# Altium schematic sheet Sheet1.SchDoc
size D
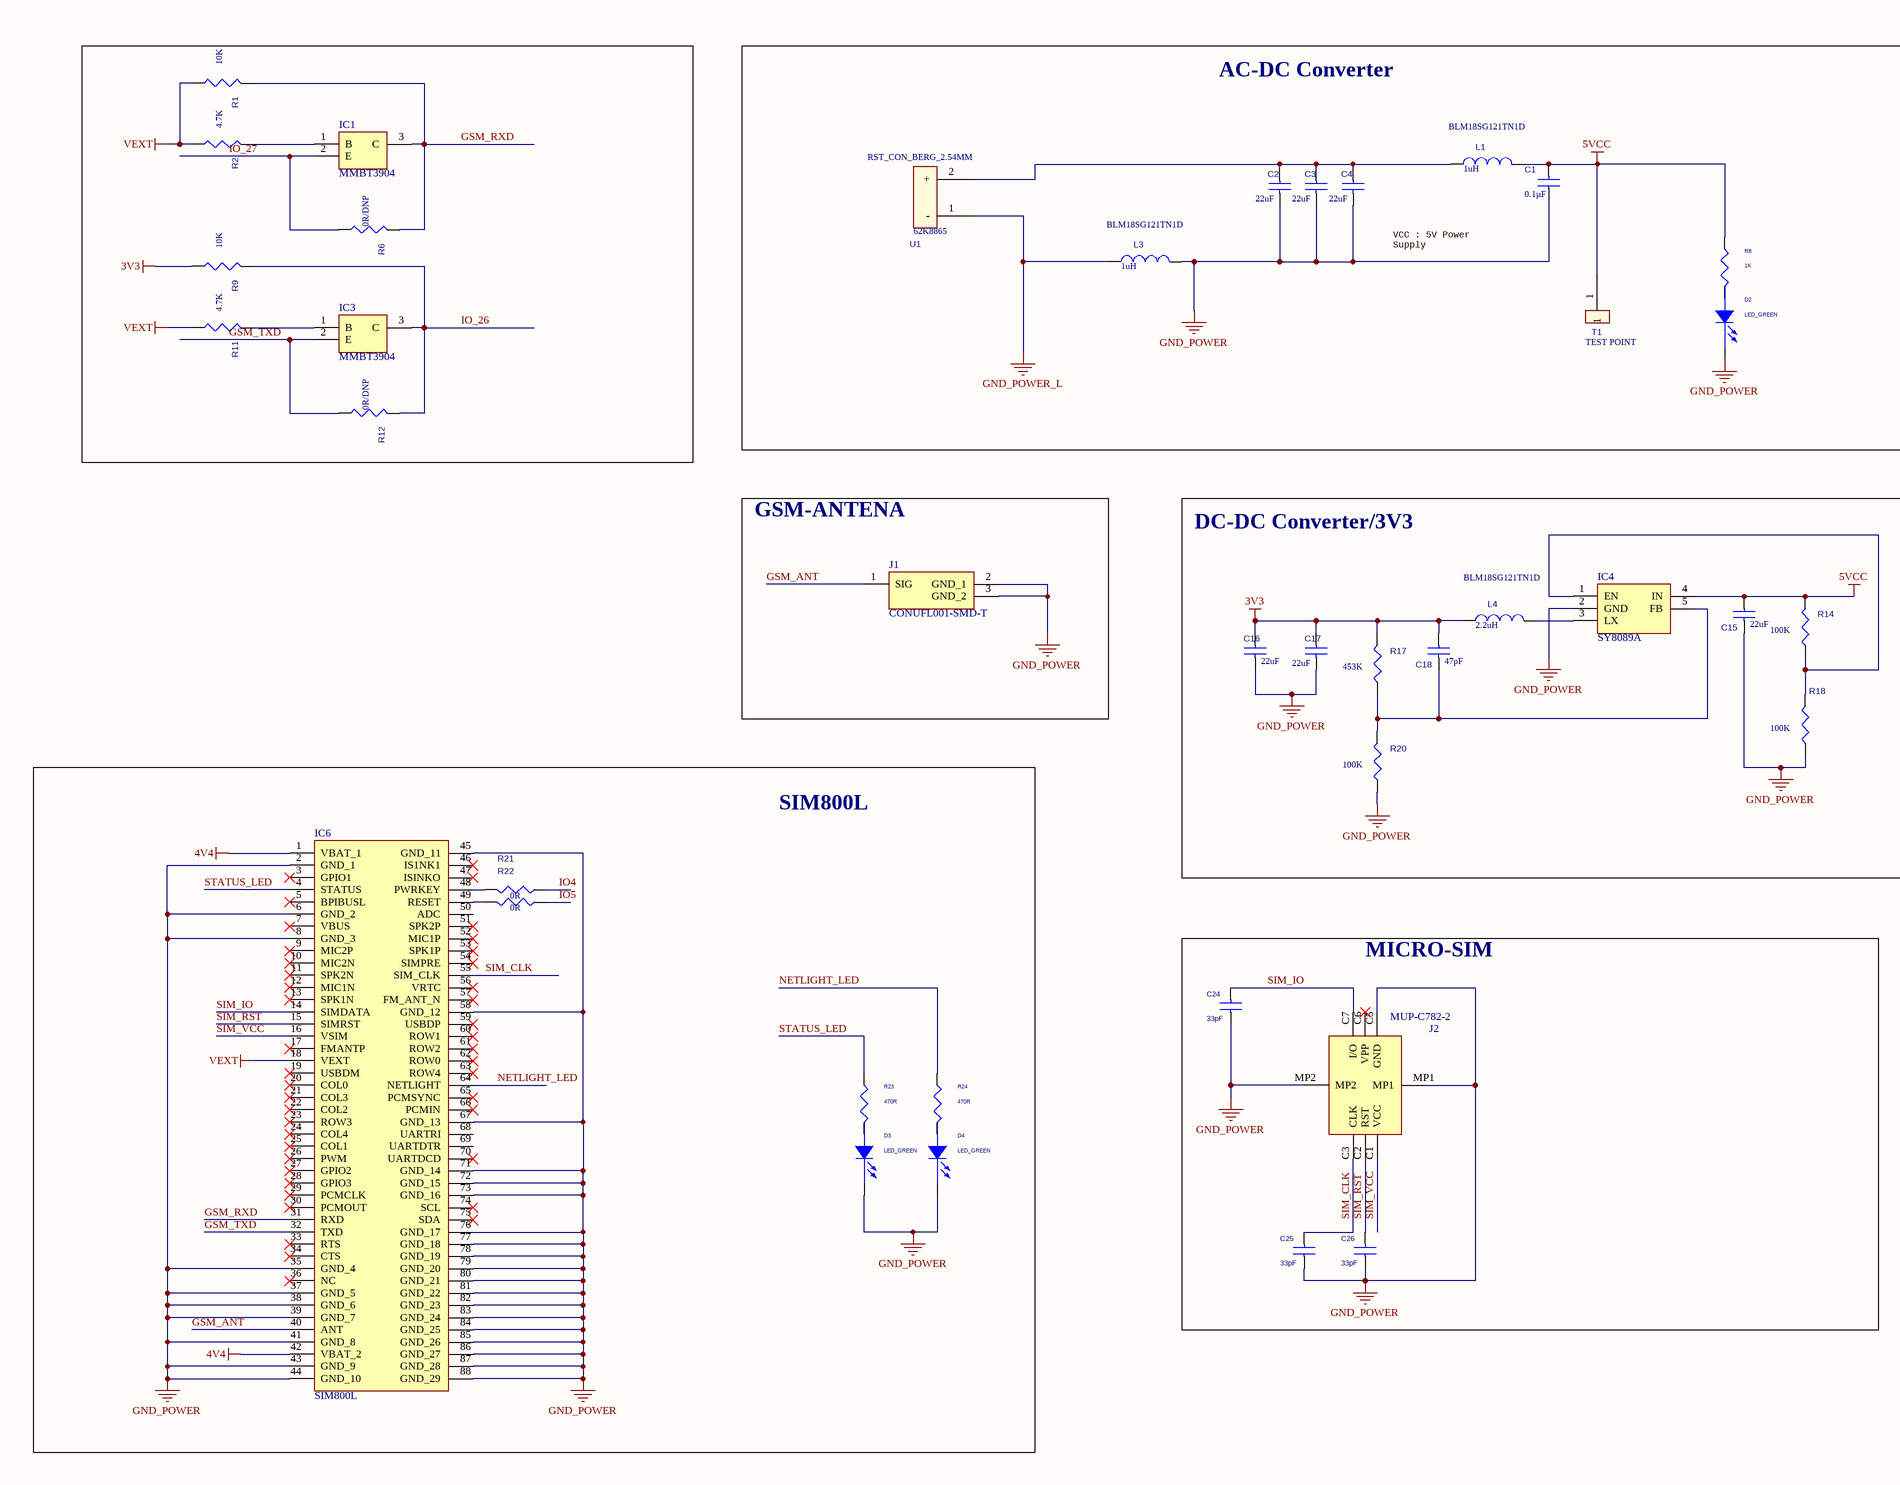
[diagram p0: Sheet1.SchDoc, left]
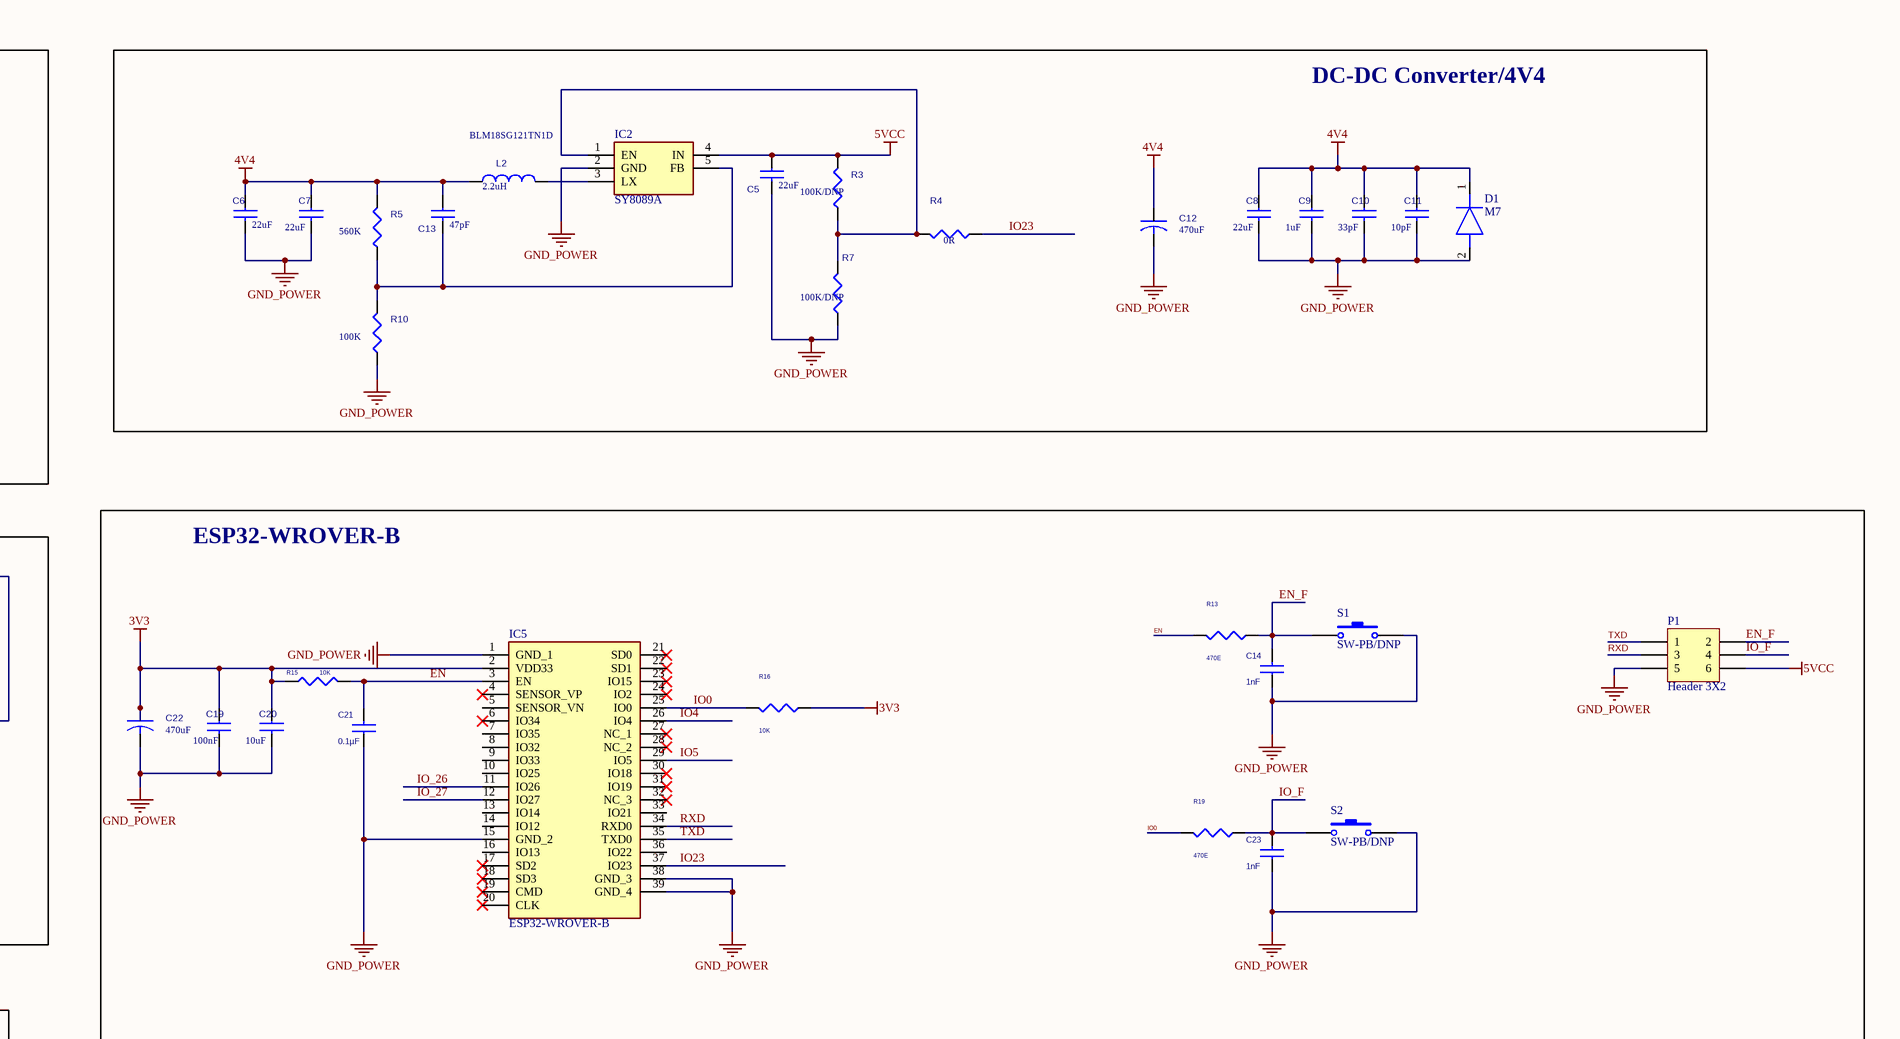
[diagram p1: Sheet1.SchDoc, right]

## Parts
C1  0.1µF  [C0603]
C2  22uF  [C0603]
C3  22uF  [C0603]
C4  22uF  [C0603]
C5  22uF  [C0603]
C6  22uF  [C0603]
C7  22uF  [C0603]
C8  22uF  [C0603]
C9  1uF  [C0603]
C10  33pF  [C0603]
C11  10pF  [C0603]
C12  470uF  [C16, C49, C58]
C13  47pF  [C0603]
C14  1nF  [0603 Capacitor]
C15  22uF  [C0603]
C16  22uF  [C0603]
C17  22uF  [C0603]
C18  47pF  [C0603]
C19  100nF  [C0603]
C20  10uF  [C0603]
C21  0.1µF  [0603 Capacitor]
C22  470uF  [25ZLH470MEFC10X12.5]
C23  1nF  [0603 Capacitor]
C24  33pF  [C0603]
C25  33pF  [C0603]
C26  33pF  [C0603]
D1  M7  [D1]
D2  LED_GREEN  [D2              L0603]
D3  LED_GREEN  [D2              L0603]
D4  LED_GREEN  [D2              L0603]
IC1  MMBT3904  [SOT95P240X120-3N]
IC2  SY8089A  [SOT95P285X140-5N]
IC3  MMBT3904  [SOT95P240X120-3N]
IC4  SY8089A  [SOT95P285X140-5N]
IC5  ESP32-WROVER-B  [MODULE_ESP32-WROVER-B]
IC6  SIM800L  [SIM800L]
J1  CONUFL001-SMD-T  [CONUFL001-SMD]
J2  MUP-C782-2  [MUPC7822]
L1  1uH  Supplier Part Number 1: BLM18SG121TN1D  [L3, L4, L5, L6, L7]
L2  2.2uH  Supplier Part Number 1: BLM18SG121TN1D  [L3, L4, L5, L6, L7]
L3  1uH  Supplier Part Number 1: BLM18SG121TN1D  [L3, L4, L5, L6, L7]
L4  2.2uH  Supplier Part Number 1: BLM18SG121TN1D  [L3, L4, L5, L6, L7]
P1  Header 3X2  [HDR2X3]
R1  10K  [R0603]
R2  4.7K  [R0603]
R3  100K/DNP  [R0603]
R4  0R  [R0603]
R5  560K  [R0603]
R6  0R/DNP  [R0603]
R7  100K/DNP  [R0603]
R8  1K  [R0603]
R9  10K  [R0603]
R10  100K  [R0603]
R11  4.7K  [R0603]
R12  0R/DNP  [R0603]
R13  470E  [R_0603_W]
R14  100K  [R0603]
R15  10K  [R_0603_W]
R16  10K  [R_0603_W]
R17  453K  [R0603]
R18  100K  [R0603]
R19  470E  [R_0603_W]
R20  100K  [R0603]
R21  0R  [R0603]
R22  0R  [R0603]
R23  470R  [R0603]
R24  470R  [R0603]
S1  SW-PB/DNP  [*TE_FSMSM]
S2  SW-PB/DNP  [*TE_FSMSM]
T1  TEST POINT  [TP]
U1  RST_CON_BERG_2.54MM  Supplier Part Number 1: 62K8865  [U23]

## Blocks framed on the sheet
AC-DC Converter: C1-C4 D2 L1 L3 R8 T1 U1
DC-DC Converter/4V4: C5-C13 D1 IC2 L2 R3-R5 R7 R10
GSM-ANTENA: J1
DC-DC Converter/3V3: C15-C18 IC4 L4 R14 R17 R18 R20
ESP32-WROVER-B: C14 C19-C23 IC5 P1 R13 R15 R16 R19 S1 S2
SIM800L: D3 D4 IC6 R21-R24
MICRO-SIM: C24-C26 J2

## Nets
3V3: C16.1 C17.1 C18.1 C19.1 C20.1 C22.1 IC5.2(VDD33) L4.1 R9.2 R15.1 R16.1 R17.1
4V4: C6.1 C7.1 C8.1 C9.1 C10.1 C11.1 C12.1 C13.1 D1.1(K) IC6.1(VBAT_1) IC6.42(VBAT_2) L2.1 R5.1
5VCC: C1.2 C5.1 C15.1 IC2.4(IN) IC4.4(IN) L1.2 P1.6 R3.1 R8.1 R14.1 T1.1
GND_POWER: C1.1 C2.2 C3.2 C4.2 C5.2 C6.2 C7.2 C8.2 C9.2 C10.2 C11.2 C12.2 C14.1 C15.2 C16.2 C17.2 C19.2 C20.2 C21.1 C22.2 C23.1 C24.1 C25.1 C26.1 D1.2(A) D2.2(CATHODE) D3.2(CATHODE) D4.2(CATHODE) IC2.2(GND) IC4.2(GND) IC5.1(GND_1) IC5.15(GND_2) IC5.38(GND_3) IC5.39(GND_4) IC6.2(GND_1) IC6.6(GND_2) IC6.8(GND_3) IC6.35(GND_4) IC6.37(GND_5) IC6.38(GND_6) IC6.39(GND_7) IC6.41(GND_8) IC6.43(GND_9) IC6.44(GND_10) IC6.45(GND_11) IC6.58(GND_12) IC6.67(GND_13) IC6.71(GND_14) IC6.72(GND_15) IC6.73(GND_16) IC6.76(GND_17) IC6.77(GND_18) IC6.78(GND_19) IC6.79(GND_20) IC6.80(GND_21) IC6.81(GND_22) IC6.82(GND_23) IC6.83(GND_24) IC6.84(GND_25) IC6.85(GND_26) IC6.86(GND_27) IC6.87(GND_28) IC6.88(GND_29) J1.2(GND_1) J1.3(GND_2) J2.C5(GND) J2.MP1 J2.MP2 L3.2 P1.5 R7.2 R10.2 R18.2 R20.2 S1.2 S2.2
GND_POWER_L: L3.1 U1.1(-)
VEXT: IC6.18(VEXT) R1.2 R2.2 R11.2
EN: C21.2 IC5.3(EN) R13.2 R15.2
EN_F: C14.2 P1.2 R13.1 S1.1
GSM_ANT: IC6.40(ANT) J1.1(SIG)
GSM_RXD: IC1.3(C) IC6.31(RXD) R1.1 R6.1
GSM_TXD: IC3.2(E) IC6.32(TXD) R12.2
IO0: IC5.25(IO0) R16.2 R19.2
IO4: IC5.26(IO4) R21.1
IO5: IC5.29(IO5) R22.1
IO23: IC5.37(IO23) R4.1
IO_26: IC3.3(C) IC5.11(IO26) R9.1 R12.1
IO_27: IC1.2(E) IC5.12(IO27) R6.2
IO_F: C23.2 P1.4 R19.1 S2.1
NETLIGHT_LED: IC6.64(NETLIGHT) R24.1
RXD: IC5.34(RXD0) P1.3
SIM_CLK: C25.2 IC6.55(SIM_CLK) J2.C3(CLK)
SIM_IO: C24.2 IC6.14(SIMDATA) J2.C7(I/O)
SIM_RST: C26.2 IC6.15(SIMRST) J2.C2(RST)
SIM_VCC: IC6.16(VSIM) J2.C1(VCC)
STATUS_LED: IC6.4(STATUS) R23.1
TXD: IC5.35(TXD0) P1.1
NetC2_1: C2.1 C3.1 C4.1 L1.1 U1.2(+)
NetC13_2: C13.2 IC2.5(FB) R5.2 R10.1
NetC18_2: C18.2 IC4.5(FB) R17.2 R20.1
NetD2_1: D2.1(ANODE) R8.2
NetD3_1: D3.1(ANODE) R23.2
NetD4_1: D4.1(ANODE) R24.2
NetIC1_1: IC1.1(B) R2.1
NetIC2_1: IC2.1(EN) R3.2 R4.2 R7.1
NetIC2_3: IC2.3(LX) L2.2
NetIC3_1: IC3.1(B) R11.1
NetIC4_1: IC4.1(EN) R14.2 R18.1
NetIC4_3: IC4.3(LX) L4.2
NetIC6_48: IC6.48(PWRKEY) R21.2
NetIC6_49: IC6.49(RESET) R22.2

Not connected (* = marked no-connect by the designer): IC5 4(SENSOR_VP)* 5(SENSOR_VN) 6(IO34)* 7(IO35) 8(IO32) 9(IO33) 10(IO25) 13(IO14) 14(IO12) 16(IO13) 17(SD2)* 18(SD3)* 19(CMD)* 20(CLK)* 21(SD0)* 22(SD1)* 23(IO15)* 24(IO2)* 27(NC_1)* 28(NC_2)* 30(IO18)* 31(IO19)* 32(NC_3)* 33(IO21) 36(IO22); IC6 3(GPIO1)* 5(BPIBUSL)* 7(VBUS)* 9(MIC2P)* 10(MIC2N)* 11(SPK2N)* 12(MIC1N)* 13(SPK1N)* 17(FMANTP)* 19(USBDM)* 20(COL0)* 21(COL3)* 22(COL2)* 23(ROW3)* 24(COL4)* 25(COL1)* 26(PWM)* 27(GPIO2)* 28(GPIO3)* 29(PCMCLK)* 30(PCMOUT)* 33(RTS)* 34(CTS)* 36(NC)* 46(IS1NK1)* 47(ISINKO)* 50(ADC) 51(SPK2P)* 52(MIC1P)* 53(SPK1P)* 54(SIMPRE)* 56(VRTC)* 57(FM_ANT_N)* 59(USBDP)* 60(ROW1)* 61(ROW2)* 62(ROW0)* 63(ROW4)* 65(PCMSYNC)* 66(PCMIN)* 68(UARTRI) 69(UARTDTR) 70(UARTDCD)* 74(SCL)* 75(SDA)*; J2 C6(VPP)*

## Notes on the sheet
- VCC : 5V Power Supply
  D-  : USB D- Signal
  D+ : USB D+ Signal
  ID  : USB Identifier Signal for OTG Devices
  GND : Power Ground
- Title
- Size:
- Date:
- File:
- D
- Number:
- Time:
- Revision:
- Sheet
- of

## Library data of the parts
C1 C14 C21 C23 = CAP_C_0.1µF/16V: CAP CER SMD 0.1µF/16V; Manufacturer: Murata Electronics North America; Manufacturer Part Number: GRM155R61H104KE19D; Tolerance: ±10%; Voltage - Rated: 16V; Temperature Coefficient: X5R; Supplier 1: Digi-Key; Supplier Part Number 1: 490-11917-1-ND; RoHS: RoHS Compliant; Category: Capacitors; Stock 1: 958509; Pricing 1: 1=0.1, 10=0.062, 25=0.0456, 50=0.034, 100=0.0278, 250=0.02328, 500=0.01988, 1000=0.01562, 5000=0.01307 (USD); Packaging: Cut Tape (CT); Part Status: Active; Operating Temperature: -55°C ~ 85°C; Features: -; Ratings: -; Applications: General Purpose; Mounting Type: Surface Mount, MLCC; Package / Case: 0402 (1005 Metric); Size / Dimension: 0.039" L x 0.020" W (1.00mm x 0.50mm); Height - Seated (Max): -; Thickness (Max): 0.022" (0.55mm); Lead Spacing: -; Lead Style: -; ComponentLink1URL: http://www.murata.com/~/media/webrenewal/support/library/catalog/products/capacitor/mlcc/c02e.ashx; ComponentLink1Description: http://www.murata.com/~/media/webrenewal/support/library/catalog/products/capacitor/mlcc/c02e.ashx
  C1 C21: Capacitance: 0.1µF
  C14 C23: Capacitance: 1nF
C2-C11 C13 C15-C20 = CAP NP: CAP CER 22UF 10V X5R 0603; Part Number: GRM188R61A226ME15D
C12 C22 = CAP: CAP ALUM 470UF 20% 50V RADIAL; Part Number: 871-B41896E6477M000
C24-C26 = CAP_C_0.1µF/16V: CAP CER SMD 0.1µF/16V; Manufacturer: Murata Electronics North America; Manufacturer Part Number: GRM155R61H104KE19D; Capacitance: 0.1µF; Tolerance: ±10%; Voltage - Rated: 16V; Temperature Coefficient: X5R; Supplier 1: Digi-Key; Supplier Part Number 1: 490-11917-1-ND; RoHS: RoHS Compliant; Category: Capacitors; Stock 1: 958509; Pricing 1: 1=0.1, 10=0.062, 25=0.0456, 50=0.034, 100=0.0278, 250=0.02328, 500=0.01988, 1000=0.01562, 5000=0.01307 (USD); Packaging: Cut Tape (CT); Part Status: Active; Operating Temperature: -55°C ~ 85°C; Features: -; Ratings: -; Applications: General Purpose; Mounting Type: Surface Mount, MLCC; Package / Case: 0402 (1005 Metric); Size / Dimension: 0.039" L x 0.020" W (1.00mm x 0.50mm); Height - Seated (Max): -; Thickness (Max): 0.022" (0.55mm); Lead Spacing: -; Lead Style: -; ComponentLink1URL: http://www.murata.com/~/media/webrenewal/support/library/catalog/products/capacitor/mlcc/c02e.ashx; ComponentLink1Description: http://www.murata.com/~/media/webrenewal/support/library/catalog/products/capacitor/mlcc/c02e.ashx
D1 = M7: Diode; Manufacturer_Name: LGE; Datasheet Link: https://datasheet.lcsc.com/szlcsc/LGE-M7-SMAJ_C330214.pdf; Height: 2.45mm; Manufacturer_Part_Number: M7
D2-D4 = LED: LED GREEN CLEAR THIN 0603 SMD; Manufacturer Part Number: 160-1443-2-ND; Type: Diode; Distributor Part Number: 160-1443-1-ND; Package: 0603; Part Number: 160-1443-2-ND
IC1 IC3 = MMBT3904: Integrated Circuit; Manufacturer_Name: Diotec; Datasheet Link: https://media.digikey.com/pdf/Data%20Sheets/ON%20Semiconductor%20PDFs/2N3904,MMBT3904,PZT3904.pdf; Height: 1.2mm; Manufacturer_Part_Number: MMBT3904; Arrow Part Number: MMBT3904; Arrow Price/Stock: https://www.arrow.com/en/products/mmbt3904/diotec-semiconductor-ag?region=europe
IC2 IC4 = SY8089A: Integrated Circuit; Manufacturer_Name: Silergy; Datasheet Link: https://datasheet.lcsc.com/szlcsc/SY8089AAAC_C78988.pdf; Height: 1.4mm; Manufacturer_Part_Number: SY8089A
IC5 = ESP32-WROVER-B: Integrated Circuit; Manufacturer_Name: Espressif Systems; Datasheet Link: https://www.espressif.com/sites/default/files/documentation/esp32-wrover-b_datasheet_en.pdf; Manufacturer_Part_Number: ESP32-WROVER-B; Mouser Part Number: 356-ESP32-WROVER-B; Mouser Price/Stock: https://www.mouser.co.uk/ProductDetail/Espressif-Systems/ESP32-WROVER-B?qs=w%2Fv1CP2dgqr%2FL2PHL8uSAQ%3D%3D
IC6 = SIM800L: Integrated Circuit; Manufacturer_Name: SIMCOM; Datasheet Link: http://img.filipeflop.com/files/download/Datasheet_SIM800L.pdf; Height: 2.55mm; Manufacturer_Part_Number: SIM800L
J1 = CONUFL001-SMD-T: Connector; Manufacturer_Name: Linx Technologies; Datasheet Link: https://linxtechnologies.com/wp/product/mhf-rf-connectors/; Manufacturer_Part_Number: CONUFL001-SMD-T; Mouser Part Number: 712-CONUFL001-SMD-T; Mouser Price/Stock: https://www.mouser.co.uk/ProductDetail/Linx-Technologies/CONUFL001-SMD-T?qs=EU6FO9ffTwfRdkBeQTdJWQ%3D%3D
J2 = MUP-C782-2: Connector; Manufacturer_Name: MUP; Datasheet Link: http://www.mupconnector.com/product/show/id/816.html; Height: 1.47mm; Manufacturer_Part_Number: MUP-C782-2
L1-L4 = INDUCTOR: FERRITE BEAD 120 OHM 0603 1LN; Part Number: 490-3996-1-ND; Supplier 1: Arrow
P1 = Header 3X2: Header, 3-Pin, Dual row; LatestRevisionDate: 17-Jul-2002; LatestRevisionNote: Re-released for DXP Platform.; Publisher: Altium Limited
R1-R3 R5-R7 R9-R12 R14 R17 R18 R20 = R: RES SMD 4.7K OHM 1% 1/16W 0603; Manufacturer Part Number: 1276-3466-2-ND; Manufacturer: Samsung; Part Number: P4.7KDBCT-ND; Type: Resistor; Rating: 1/16W; Tolerance: 1%; Distributor: Digikey; Distributor Part Number: 1276-3466-2-ND; Package: 0603
R4 R13 R16 R19 R21 R22 = R: RES SMD 470 OHM 1% 1/10W 0603; Part Number: 311-470HRCT-ND; Type: Resistor; Package: 0603
R8 R23 R24 = R: RES SMD 1K OHM 5% 1/10W 0603; Part Number: 311-1.0KGRTR-ND; Package: 0603; Type: Resistor
R15 = R: RES SMD 4.7K OHM 1% 1/16W 0603; Part Number: 311-10KGRTR-ND; Package: 0603; Type: Resistor
S1 S2 = SW-PB: Switch; Published: 24-Mar-1999; LatestRevisionDate: 17-Jul-2002; LatestRevisionNote: Re-released for DXP Platform.; PackageReference: SPST-2; Publisher: Altium Limited; PackageDescription: Switch; 2 Leads
T1 = Test_P
U1 = CON_AC_1: CONN HEADER VERT 2POS 2.54MM; Part Number: 609-4434-ND; Supplier 1: Newark